# EAGLE design Joystick Module B (EAGLE 8.4.1)
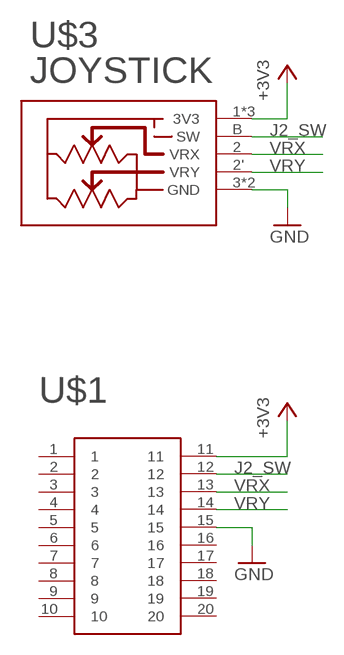
[diagram p0: schematic, sheet 1]

## Parts
U$1  EDGE_CONNECTOR_20POS_CONTACTS  [EDGE_CONNECTOR_20POS_CONTACTS]
U$3  JOYSTICK"  [JOYSTICK]

## Nets
+3V3: U$1.11 U$3.1'(3V3) U$3.1(3V3) U$3.A(3V3)
GND: U$1.15 U$3.3'(GND) U$3.3(GND)
J2_SW: U$1.12 U$3.B(SW)
VRX: U$1.13 U$3.2(VRX)
VRY: U$1.14 U$3.2'(VRY)
Unconnected: U$1.1 U$1.2 U$1.3 U$1.4 U$1.5 U$1.6 U$1.7 U$1.8 U$1.9 U$1.10 U$1.16 U$1.17 U$1.18 U$1.19 U$1.20

## Library data of the parts
U$1 = thanics_robotics:EDGE_CONNECTOR_20POS_CONTACTS
U$3 = thanics_robotics:JOYSTICK

## Board
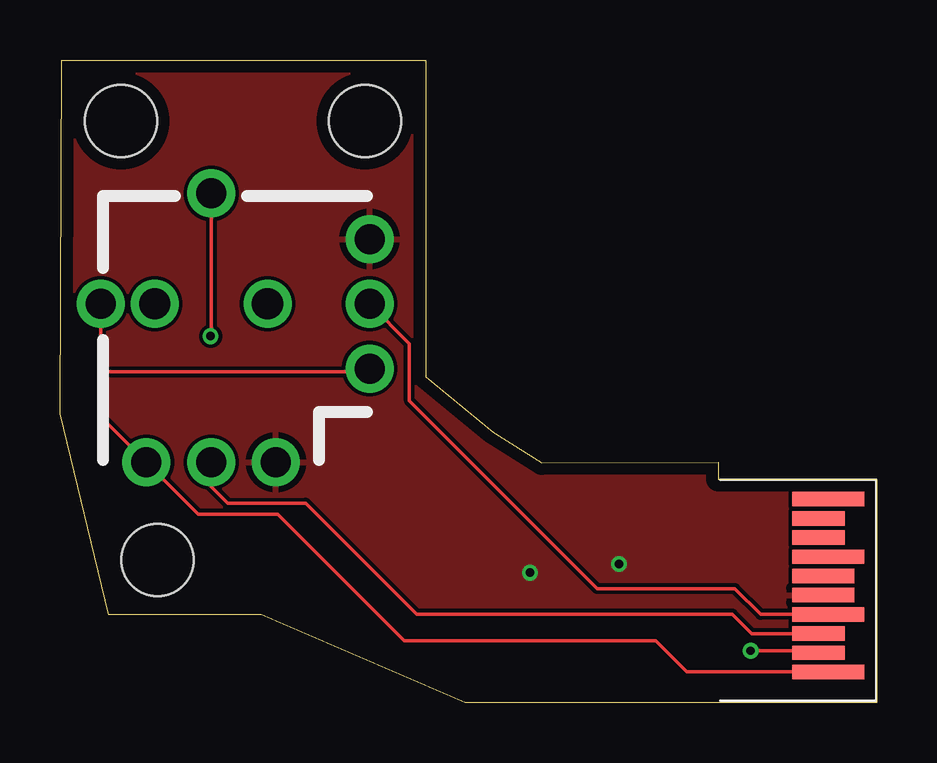
[diagram p1: board, top side]
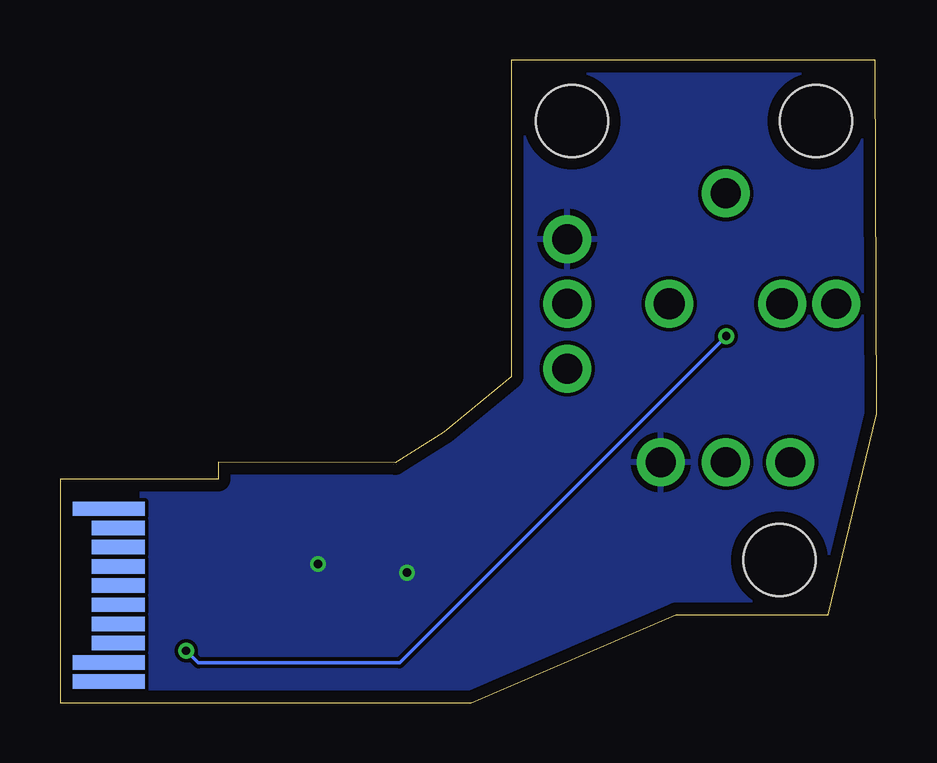
[diagram p2: board, bottom side, seen from below]

Size 34.04 x 26.77 mm. Coordinates in mm from the lower left corner, seen from the top.
Outline: 34.04,0 16.89,0 8.38,3.66 2.03,3.66 0,12.04 0.08,26.76 15.24,26.77 15.24,13.56 18.04,11.27 20.07,10 27.43,10.01 27.43,9.3 34.04,9.3 34.04,0
Copper layers (1*16): Top 0.035mm / dielectric 1.6mm / Bottom 0.035mm
Design rules "Elecrow_2-layer_PCB_eagle_rule": minimum track width 6mil, minimum drill 12mil, track to track 6mil, track to pad 6mil, pad to pad 6mil, via to via 8mil, smd to smd 0mil, copper to edge 20mil, drill to drill 10mil, minimum pad ring 6mil, minimum via ring 6mil, stop-mask expansion 0mil, vias tented up to drill 100mil, thermal gap 10mil
Holes 3 mm at 4.06,5.94 12.7,24.23 2.54,24.23

### Footprints (pad centres in the part's own frame; a part is rotated, then mirrored left to right if it is on the bottom)
EDGE_CONNECTOR_20POS_CONTACTS = smd 0.6 x 3 bottom: 1 -3.4,0; 9 3,0; 10 3.8,0 | smd 0.6 x 2.2 bottom: 2 -2.6,-0.4; 3 -1.8,-0.4; 4 -1,-0.4; 5 -0.2,-0.4; 6 0.6,-0.4; 7 1.4,-0.4; 8 2.2,-0.4 | smd 0.6 x 3: 11 3.4,0; 14 1,0; 17 -1.4,0; 20 -3.8,0 | smd 0.6 x 2.2: 12 2.6,-0.4; 13 1.8,-0.4; 18 -2.2,-0.4; 19 -3,-0.4 | smd 0.6 x 2.6: 15 0.2,-0.2; 16 -0.6,-0.2
JOYSTICK = drill 1.25 pad 2: 1 -6.6,2.7; 1' -2.7,-6.6; 2 -6.6,0; 2' 0,-6.6; 3 -6.6,-2.7; 3' 2.7,-6.6; A 0,4.6; B 4.6,0 | drill 1.3 pad 2: P$9 0,2.35; P$10 0,-2.35

### Placement (x,y rotation side)
U$1  32,4.67 270 top
U$3  6.3,16.61 90 top

### Tracks (layer width: path | path; a pad name or v marks a point on that pad's centre or on a via)
+3V3
  Top 0.152: 1.7,13.79 1.7,11.91 U$3.1 5.76,7.85 9.07,7.85 14.35,2.57 24.82,2.57 26.11,1.27 U$1.11 | 1.7,13.79 U$3.A | 1.7,13.79 12.78,13.79 U$3.1'
GND  (via drill 0.35)
  other vias: 19.58,5.41 23.29,5.77
  pour Bottom: -1.78,40.18 30.66,40.13 30.66,-9.4 -1.78,-9.35
  pour Top: -1.22,40.01 30.66,40.08 30.66,-9.45 -1.22,-9.53
J2_SW  (via drill 0.35)
  Top 0.152: U$3.B 6.3,15.29 v6.27,15.27 | v28.78,2.16 31.52,2.16 U$1.12
  Bottom 0.152: v6.27,15.27 19.89,1.65 28.27,1.65 v28.78,2.16
VRX
  Top 0.152: U$3.2 6.3,8.99 6.98,8.31 10.24,8.31 14.86,3.68 28.02,3.68 28.83,2.87 U$1.13
VRY
  Top 0.152: U$3.2' 14.55,14.96 14.55,12.57 22.38,4.75 28.12,4.75 29.19,3.67 U$1.14